# EasyEDA schematic macrokeyboard_2020-07-03_19-43-42.json
TITLE: New Schematic; REV: 1.0; Date: 2018-08-10; Sheet: 1/1; Drawn By: angelbirth
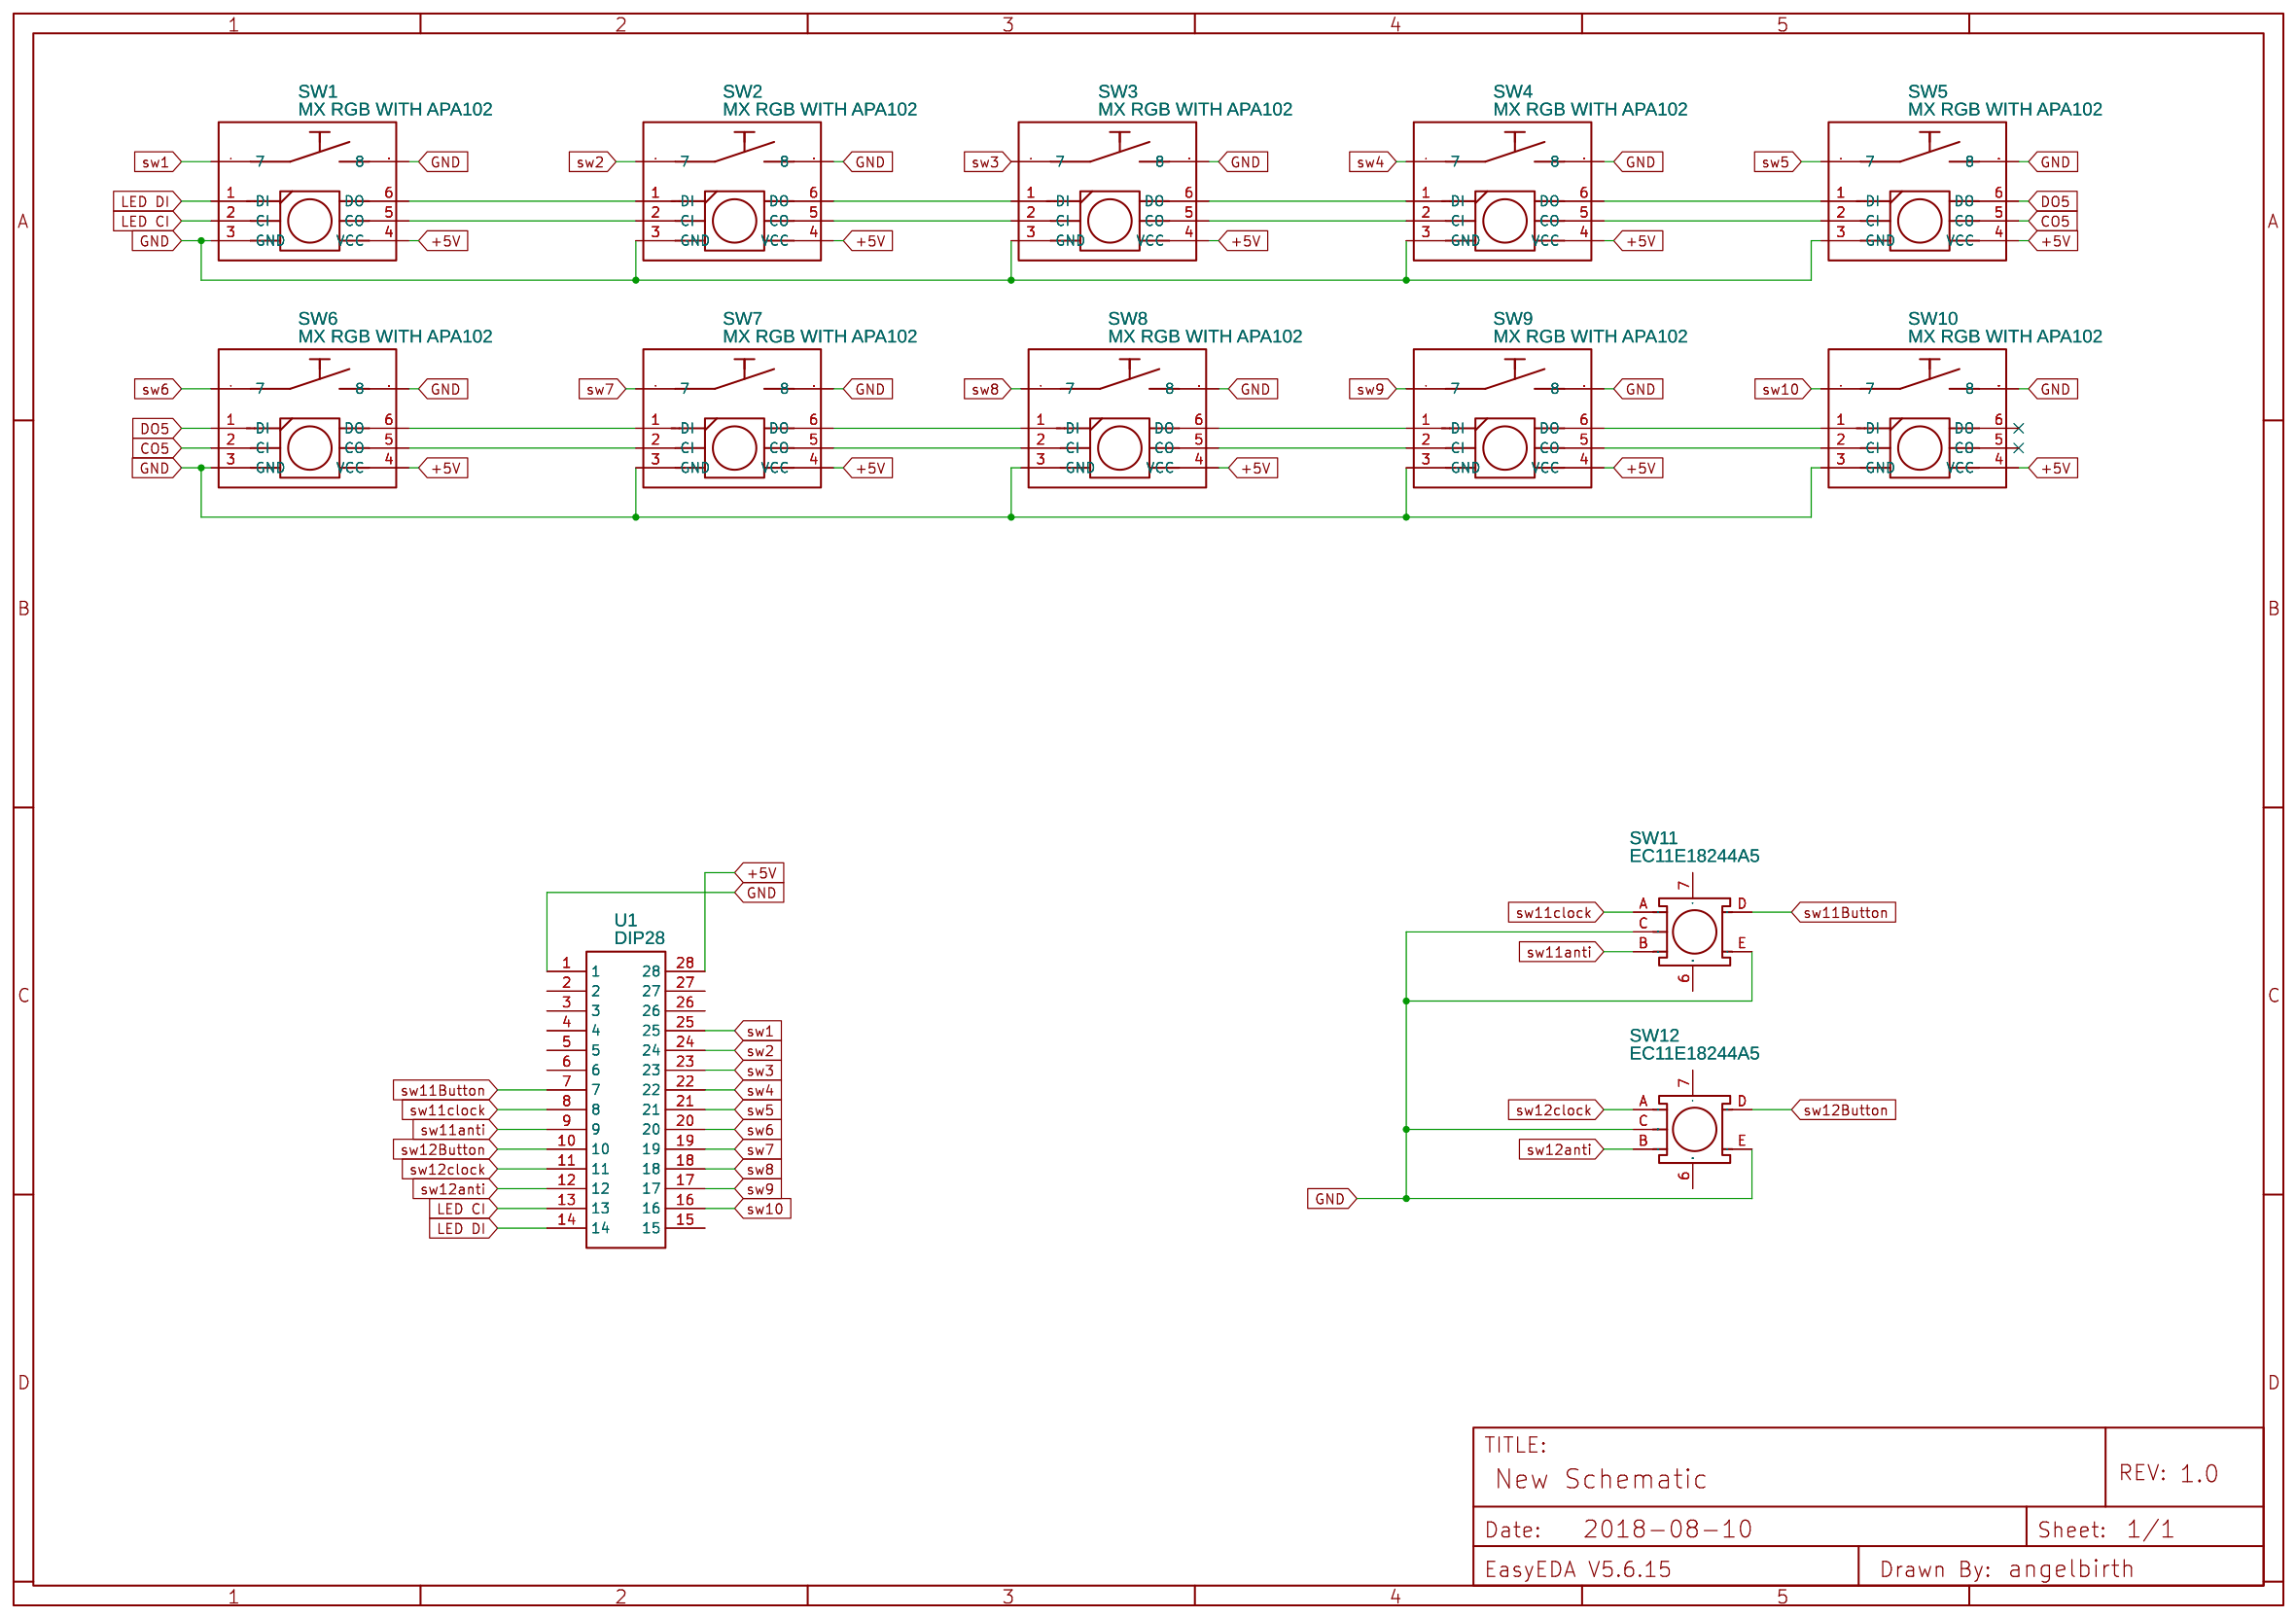
[diagram p0: schematic sheet]

## Parts
SW1  MX RGB WITH APA102  [CHERRY MX RGB WITH LED]
SW2  MX RGB WITH APA102  [CHERRY MX RGB WITH LED]
SW3  MX RGB WITH APA102  [CHERRY MX RGB WITH LED]
SW4  MX RGB WITH APA102  [CHERRY MX RGB WITH LED]
SW5  MX RGB WITH APA102  [CHERRY MX RGB WITH LED]
SW6  MX RGB WITH APA102  [CHERRY MX RGB WITH LED]
SW7  MX RGB WITH APA102  [CHERRY MX RGB WITH LED]
SW8  MX RGB WITH APA102  [CHERRY MX RGB WITH LED]
SW9  MX RGB WITH APA102  [CHERRY MX RGB WITH LED]
SW10  MX RGB WITH APA102  [CHERRY MX RGB WITH LED]
SW11  EC11E18244A5  [SW-TH_EC11E18244A5]
SW12  EC11E18244A5  [SW-TH_EC11E18244A5]
U1  DIP28  [DIP-28_L35.6-W17.8-P2.54-LS15.2-BL]

## Library data of the parts
SW1-SW10 = MX RGB WITH APA102: Contributor: Keith
SW11 SW12 = EC11E18244A5: Supplier: LCSC; Supplier Part: C255515; Manufacturer: ALPS Electric; Contributor: LCSC
U1 = DIP28: Contributor: Alexis.H; Package Display: No

## Nets
+5V: SW1.4(VCC) SW2.4(VCC) SW3.4(VCC) SW4.4(VCC) SW5.4(VCC) SW6.4(VCC) SW7.4(VCC) SW8.4(VCC) SW9.4(VCC) SW10.4(VCC) U1.28
GND: SW1.3(GND) SW1.8 SW2.3(GND) SW2.8 SW3.3(GND) SW3.8 SW4.3(GND) SW4.8 SW5.3(GND) SW5.8 SW6.3(GND) SW6.8 SW7.3(GND) SW7.8 SW8.3(GND) SW8.8 SW9.3(GND) SW9.8 SW10.3(GND) SW10.8 SW11.C SW11.E SW12.C SW12.E U1.1
CO5: SW5.5(CO) SW6.2(CI)
DO5: SW5.6(DO) SW6.1(DI)
LED CI: SW1.2(CI) U1.13
LED DI: SW1.1(DI) U1.14
sw1: SW1.7 U1.25
sw2: SW2.7 U1.24
sw3: SW3.7 U1.23
sw4: SW4.7 U1.22
sw5: SW5.7 U1.21
sw6: SW6.7 U1.20
sw7: SW7.7 U1.19
sw8: SW8.7 U1.18
sw9: SW9.7 U1.17
sw10: SW10.7 U1.16
sw11anti: SW11.B U1.9
sw11Button: SW11.D U1.7
sw11clock: SW11.A U1.8
sw12anti: SW12.B U1.12
sw12Button: SW12.D U1.10
sw12clock: SW12.A U1.11
Net-(SW1-5): SW1.5(CO) SW2.2(CI)
Net-(SW1-6): SW1.6(DO) SW2.1(DI)
Net-(SW2-5): SW2.5(CO) SW3.2(CI)
Net-(SW2-6): SW2.6(DO) SW3.1(DI)
Net-(SW3-5): SW3.5(CO) SW4.2(CI)
Net-(SW3-6): SW3.6(DO) SW4.1(DI)
Net-(SW4-5): SW4.5(CO) SW5.2(CI)
Net-(SW4-6): SW4.6(DO) SW5.1(DI)
Net-(SW6-5): SW6.5(CO) SW7.2(CI)
Net-(SW6-6): SW6.6(DO) SW7.1(DI)
Net-(SW7-5): SW7.5(CO) SW8.2(CI)
Net-(SW7-6): SW7.6(DO) SW8.1(DI)
Net-(SW8-5): SW8.5(CO) SW9.2(CI)
Net-(SW8-6): SW8.6(DO) SW9.1(DI)
Net-(SW9-5): SW9.5(CO) SW10.2(CI)
Net-(SW9-6): SW9.6(DO) SW10.1(DI)

Not connected (* = marked no-connect by the designer): SW10 5(CO)* 6(DO)*; SW11 6 7; SW12 6 7; U1 2 3 4 5 6 15 26 27
